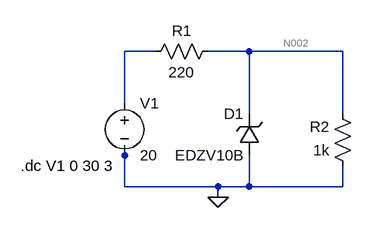
[diagram p0: schematic line_regulation eclab3(6 in manual).asc]
line_regulation eclab3(6 in manual).asc, the LTspice schematic file:
Version 4
SHEET 1 880 680
WIRE 64 48 16 48
WIRE 208 48 144 48
WIRE 352 48 208 48
WIRE 16 128 16 48
WIRE 208 144 208 48
WIRE 352 144 352 48
WIRE 16 208 16 192
WIRE 16 256 16 208
WIRE 160 256 16 256
WIRE 208 256 208 208
WIRE 208 256 160 256
WIRE 352 256 352 224
WIRE 352 256 208 256
WIRE 160 272 160 256
FLAG 160 272 0
SYMBOL zener 224 208 R180
WINDOW 0 24 64 Left 2
WINDOW 3 24 0 Left 2
SYMATTR InstName D1
SYMATTR Value EDZV10B
SYMATTR Description Diode
SYMATTR Type diode
SYMBOL voltage 16 112 R0
WINDOW 123 0 0 Left 0
WINDOW 39 0 0 Left 0
SYMATTR InstName V1
SYMATTR Value 20
SYMBOL res 160 32 R90
WINDOW 0 0 56 VBottom 2
WINDOW 3 32 56 VTop 2
SYMATTR InstName R1
SYMATTR Value 220
SYMBOL res 368 240 R180
WINDOW 0 36 76 Left 2
WINDOW 3 36 40 Left 2
SYMATTR InstName R2
SYMATTR Value 1k
TEXT -144 224 Left 2 !.dc V1 0 30 3

The netlist it stands for:
* line_regulation eclab3(6 in manual).asc
D1 0 N002 EDZV10B
V1 N001 0 20
R1 N002 N001 220
R2 0 N002 1k
.model D D
.lib standard.dio
.dc V1 0 30 3
.backanno
.end

* Results of the author's LTspice run, read from the files saved beside the schematic
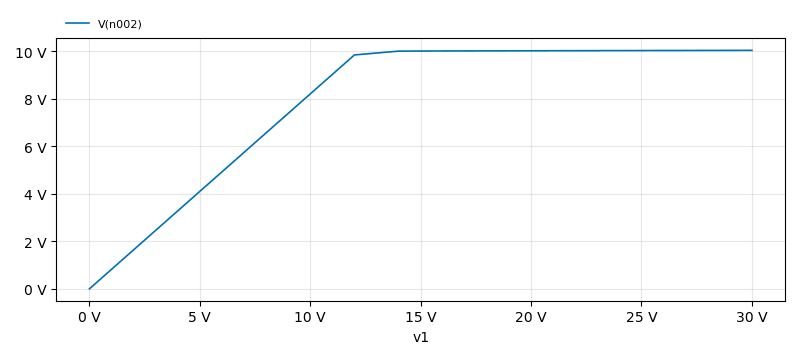
[diagram p1: DC transfer characteristic of line_regulation eclab3(6 in manual).asc, plotted from the saved traces]
* DC transfer characteristic, 1 run:
*   V(n002): 0 V at v1=0 V, 10.03 V at v1=30 V, min 0 V, max 10.03 V